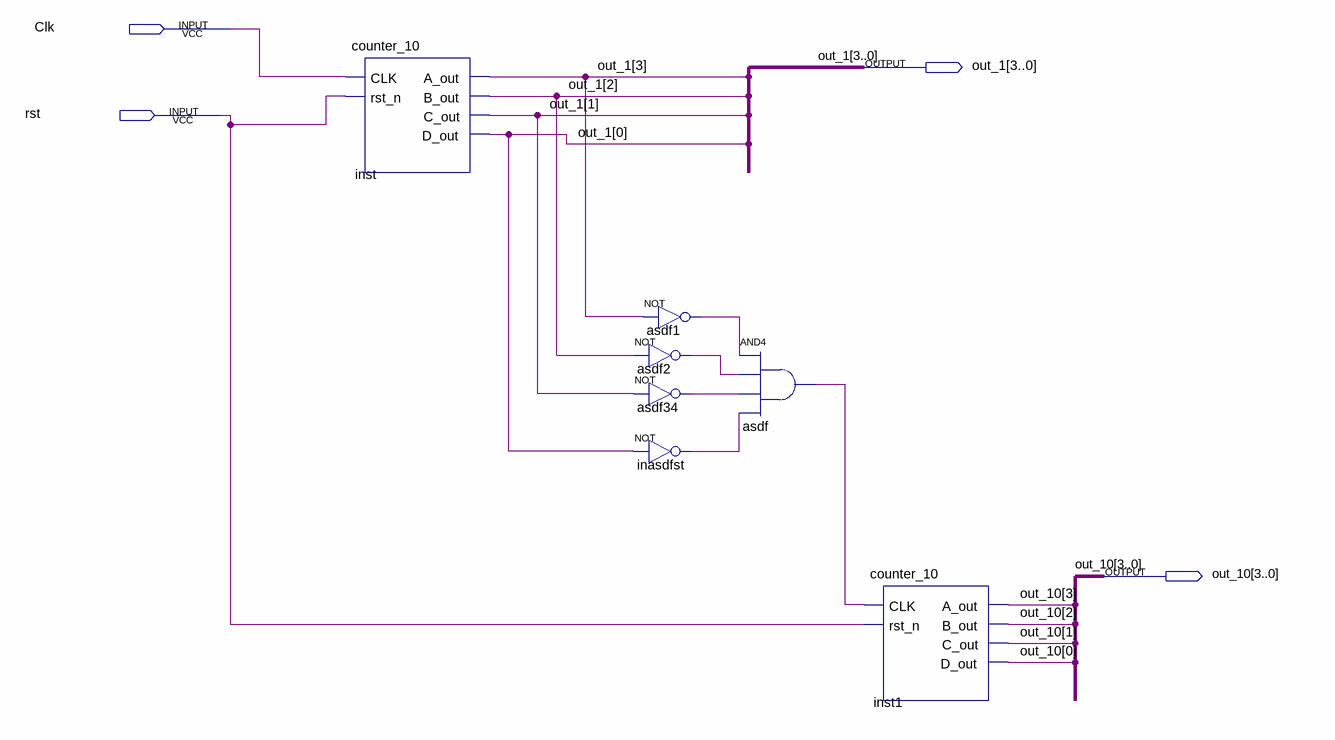
[diagram p0: schematic sheet]
// Quartus schematic counter_100.bdf as structural Verilog: 7 symbols, 4 pins
module counter_100 (
  input  Clk,
  input  rst,
  output [3:0] out_1,
  output [3:0] out_10
);

  wire asdf1_out, asdf2_out, asdf34_out, asdf_out, inasdfst_out;

  counter_10 inst (.CLK(Clk), .rst_n(rst), .A_out(out_1[3]), .B_out(out_1[2]), .C_out(out_1[1]), .D_out(out_1[0]));
  not asdf1 (asdf1_out, out_1[3]);
  not asdf2 (asdf2_out, out_1[2]);
  not asdf34 (asdf34_out, out_1[1]);
  not inasdfst (inasdfst_out, out_1[0]);
  and asdf (asdf_out, asdf1_out, asdf2_out, asdf34_out, inasdfst_out);
  counter_10 inst1 (
    .CLK(asdf_out), .rst_n(rst), .A_out(out_10[3]), .B_out(out_10[2]), .C_out(out_10[1]), .D_out(out_10[0]));
endmodule
